# EAGLE design chicken_door_h_bridge_inv (EAGLE 5.11)
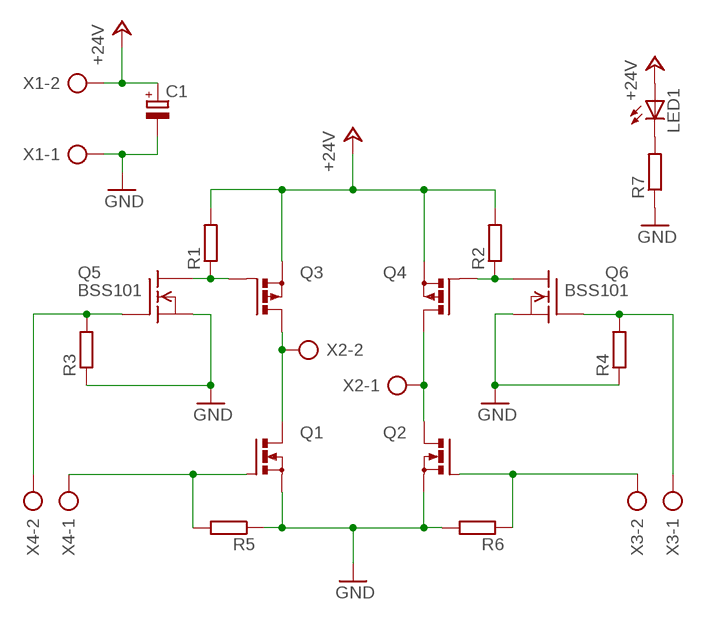
[diagram p0: schematic, sheet 1]

## Parts
C1  CPOL-EUE5-8.5  [E5-8,5]
LED1  LED3MM  [LED3MM]
Q1  PMOSFET_NTO220BV  [TO220BV]
Q2  PMOSFET_NTO220BV  [TO220BV]
Q3  PMOSFET_PTO220BV  [TO220BV]
Q4  PMOSFET_PTO220BV  [TO220BV]
Q5  BSS101  [TO92]
Q6  BSS101  [TO92]
R1  R-EU_0204/5  [0204/5]
R2  R-EU_0204/5  [0204/5]
R3  R-EU_0204/5  [0204/5]
R4  R-EU_0204/5  [0204/5]
R5  R-EU_0204/5  [0204/5]
R6  R-EU_0204/5  [0204/5]
R7  R-EU_0204/5  [0204/5]
X1  AK500/2  [AK500/2]
X2  AK500/2  [AK500/2]
X3  AK500/2  [AK500/2]
X4  AK500/2  [AK500/2]

## Nets
+24V: C1.+ LED1.A Q3.S Q4.S R1.2 R2.2 X1.2
GND: C1.- Q1.S Q2.S Q5.1(S) Q6.1(S) R3.1 R4.1 R5.1 R6.2 R7.1 X1.1
N$1: Q1.D Q3.D X2.2
N$2: Q2.D Q4.D X2.1
N$4: Q4.G Q6.3(D) R2.1
N$5: Q1.G R5.2 X4.1
N$6: Q2.G R6.1 X3.2
N$7: Q3.G Q5.3(D) R1.1
N$9: Q5.2(G) R3.2 X4.2
N$10: LED1.K(C) R7.2
N$11: Q6.2(G) R4.2 X3.1

## Library data of the parts
C1 = rcl:CPOL-EU: POLARIZED CAPACITOR, European symbol
LED1 = led:LED: LED OSRAM: - CHIPLED LG R971, LG N971, LY N971, LG Q971, LY Q971, LO R971, LY R971 LH N974, LH R974 LS Q976, LO Q976, LY Q976 LO Q996 - Hyper CHIPLED LW Q18S LB Q993, LB Q99A, LB R99A - SideLED LS A670, LO A670, LY A670, LG A670, LP A670 LB A673, LV A673, LT A673, LW A673 LH A674 LY A675 LS A676, LA A676, LO A676, LY A676, LW A676 LS A679, LY A679, LG A679 - Hyper Micro SIDELED® LS Y876, LA Y876, LO Y876, LY Y876 LT Y87S - SmartLED LW L88C, LW L88S LB L89C, LB L89S, LG L890 LS L89K, LO L89K, LY L89K LS L896, LA L896, LO L896, LY L896 - TOPLED LS T670, LO T670, LY T670, LG T670, LP T670 LSG T670, LSP T670, LSY T670, LOP T670, LYG T670 LG T671, LOG T671, LSG T671 LB T673, LV T673, LT T673, LW T673 LH T674 LS T676, LA T676, LO T676, LY T676, LB T676, LH T676, LSB T676, LW T676 LB T67C, LV T67C, LT T67C, LS T67K, LO T67K, LY T67K, LW E67C LS E67B, LA E67B, LO E67B, LY E67B, LB E67C, LV E67C, LT E67C LW T67C LS T679, LY T679, LG T679 LS T770, LO T770, LY T770, LG T770, LP T770 LB T773, LV T773, LT T773, LW T773 LH T774 LS E675, LA E675, LY E675, LS T675 LS T776, LA T776, LO T776, LY T776, LB T776 LHGB T686 LT T68C, LB T68C - Hyper Mini TOPLED® LB M676 - Mini TOPLED Santana® LG M470 LS M47K, LO M47K, LY M47K Source: http://www.osram.convergy.de LUXEON: - LUMILED® LXK2-PW12-R00, LXK2-PW12-S00, LXK2-PW14-U00, LXK2-PW14-V00 LXK2-PM12-R00, LXK2-PM12-S00, LXK2-PM14-U00 LXK2-PE12-Q00, LXK2-PE12-R00, LXK2-PE12-S00, LXK2-PE14-T00, LXK2-PE14-U00 LXK2-PB12-K00, LXK2-PB12-L00, LXK2-PB12-M00, LXK2-PB14-N00, LXK2-PB14-P00, LXK2-PB14-Q00 LXK2-PR12-L00, LXK2-PR12-M00, LXK2-PR14-Q00, LXK2-PR14-R00 LXK2-PD12-Q00, LXK2-PD12-R00, LXK2-PD12-S00 LXK2-PH12-R00, LXK2-PH12-S00 LXK2-PL12-P00, LXK2-PL12-Q00, LXK2-PL12-R00 Source: www.luxeon.com KINGBRIGHT: KA-3528ASYC Source: www.kingbright.com
Q1 Q2 = transistor-power:PMOSFET_N: Power MOSFET N-Channel
Q3 Q4 = transistor-power:PMOSFET_P: Power MOSFET P-Channel
Q5 Q6 = transistor-fet:BSS101: N-Channel Enhancement MOSFET 200V; 0,16A; 11Ohm
R1-R7 = resistor:R-EU_: RESISTOR, European symbol
X1-X4 = con-ptr500:AK500/2: CONNECTOR; OC_FARNELL: unknown; OC_NEWARK: unknown

## Board
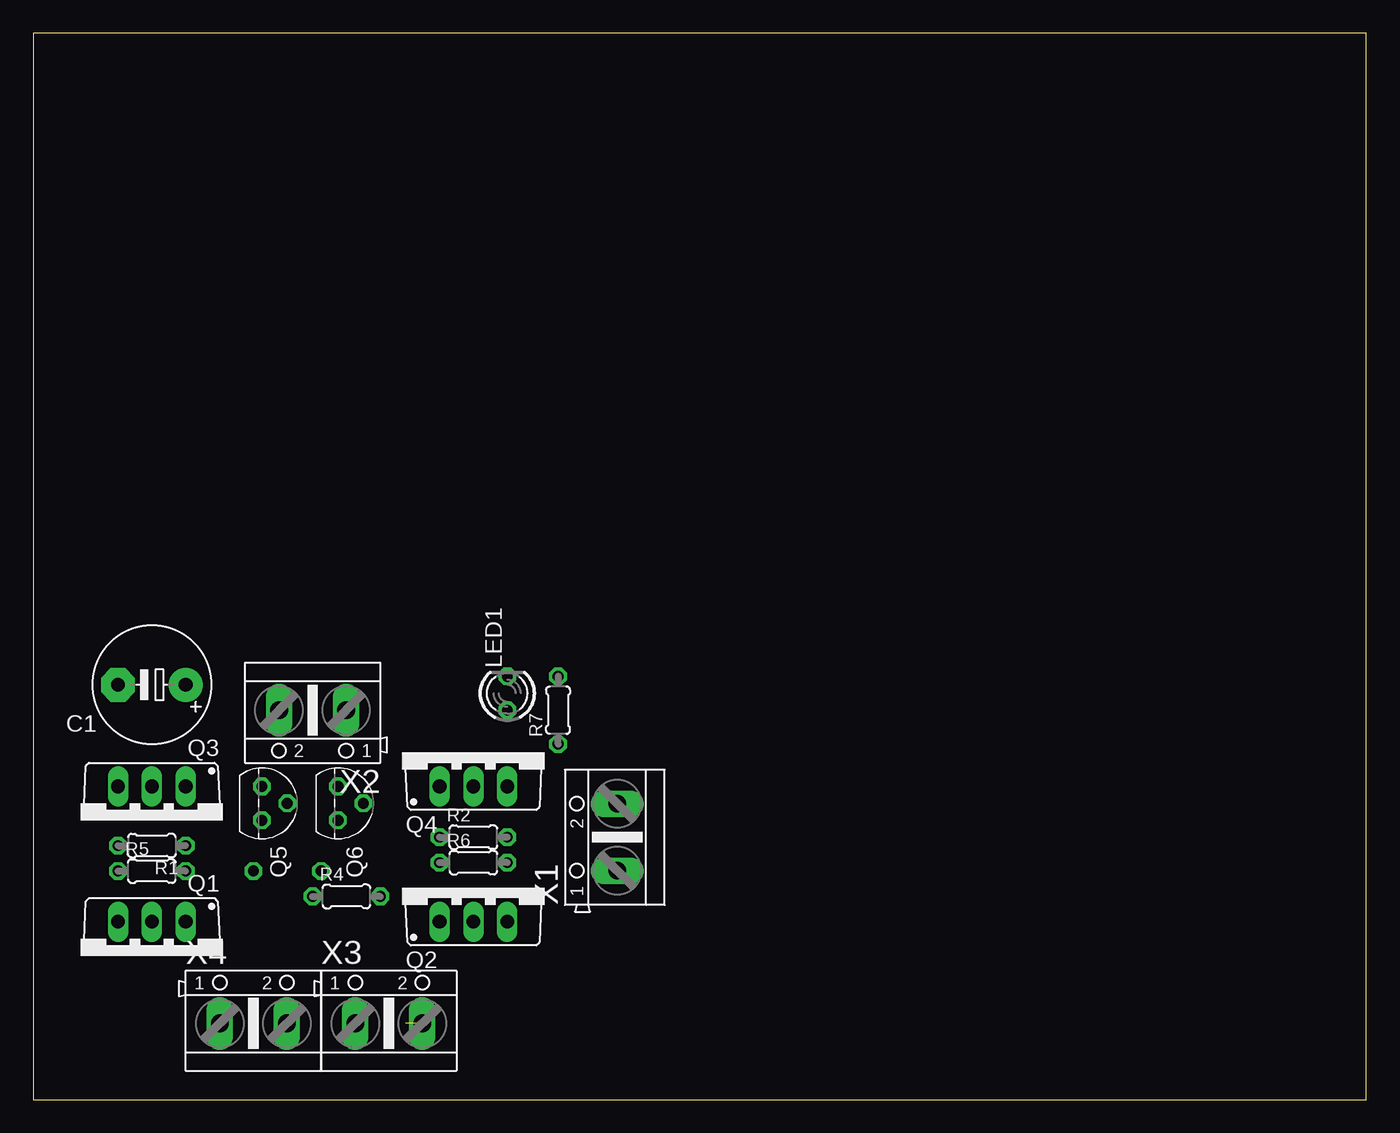
[diagram p1: board, top side]
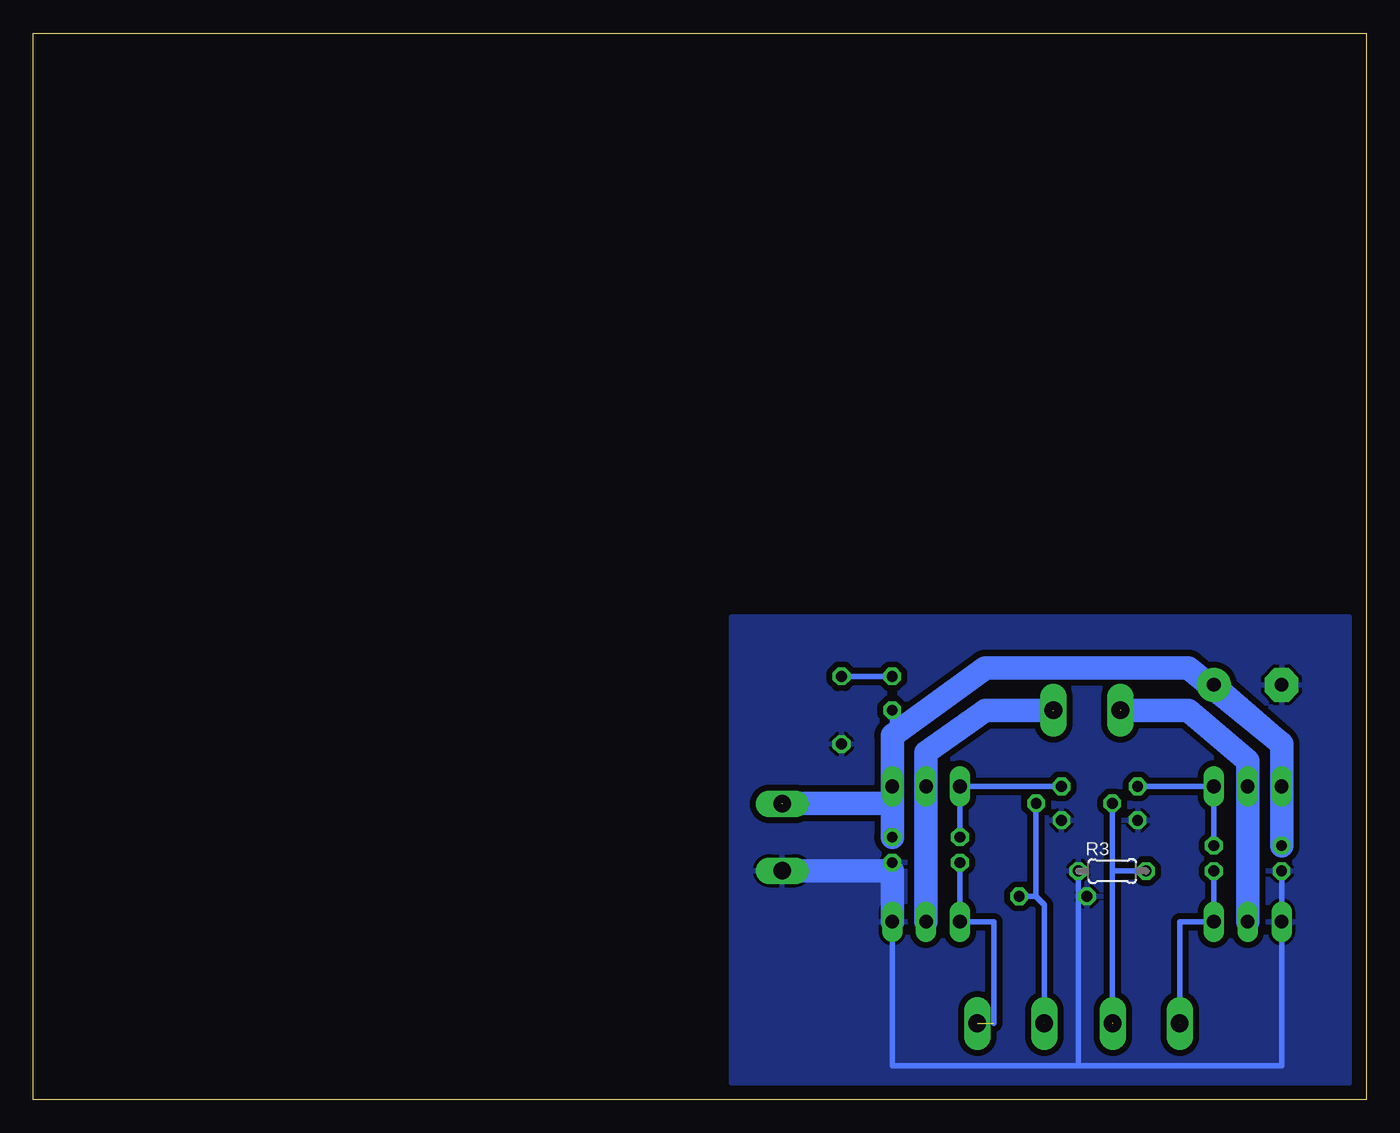
[diagram p2: board, bottom side, seen from below]

Size 100 x 80 mm. Coordinates in mm from the lower left corner, seen from the top.
Outline: 0,0 100,0 100,80 0,80 0,0
Copper layers (1*16): Top 0.035mm / dielectric 1.5mm / Bottom 0.035mm
Design rules "default *": minimum track width 10mil, minimum drill 24mil, track to track 18mil, track to pad 18mil, pad to pad 8mil, via to via 8mil, smd to smd 8mil, copper to edge 40mil, drill to drill 8mil, minimum pad ring 10mil, minimum via ring 8mil, stop-mask expansion 4mil, vias tented up to drill 0mil, thermal gap 10mil

### Footprints (pad centres in the part's own frame; a part is rotated, then mirrored left to right if it is on the bottom)
E5-8,5 = drill 1.016 pad 2.54 round: + -2.54,0 | drill 1.016 pad 2.54 octagon: - 2.54,0
LED3MM = drill 0.813 octagon: A -1.27,0; K 1.27,0
TO220BV = drill 1.016 long: D 0,-2.54; G -2.54,-2.54; S 2.54,-2.54
TO92 = drill 0.813 octagon: 1 1.27,0; 2 0,1.905; 3 -1.27,0
0204/5 = drill 0.813 octagon: 1 -2.54,0; 2 2.54,0
AK500/2 = drill 1.321 long: 1 -2.515,0; 2 2.515,0

### Placement (x,y rotation side)
C1  8.89,31.11 180 top
LED1  35.56,30.48 90 top
Q1  8.89,10.79 180 top
Q2  33.02,15.88 0 top
Q3  8.89,20.95 180 top
Q4  33.02,26.04 0 top
Q5  17.14,22.23 270 top
Q6  22.86,22.23 270 top
R1  8.89,19.05 180 top
R2  33.02,19.68 0 top
R3  19.05,17.14 0 bottom
R4  23.5,15.24 0 top
R5  8.89,17.14 0 top
R6  33.02,17.78 0 top
R7  39.37,29.21 90 top
X1  43.81,19.68 90 top
X2  20.95,29.21 180 top
X3  26.67,5.71 0 top
X4  16.51,5.71 0 top

### Tracks (layer width: path | path; a pad name or v marks a point on that pad's centre or on a via)
+24V  (1 unrouted)
  Bottom 0.406: 35.56,27.3 LED1.A
  Bottom 1.778: R1.2 Q3.S 6.35,26.67 | 6.35,26.67 13.34,32.38 28.57,32.38 35.56,27.3 Q4.S 35.56,22.23 | 35.56,22.23 R2.2 | 6.35,26.67 C1.+ | 35.56,22.23 43.81,22.23
GND
  Bottom 0.406: R5.1 Q1.S 6.35,2.54 21.59,2.54 | 21.59,2.54 35.56,2.54 Q2.S | 35.56,17.14 R6.2 | 21.59,2.54 R3.1
  Bottom 1.778: 43.81,17.14 35.56,17.14 Q2.S
  pour Bottom: 1.27,36.2 47.62,36.2 47.62,1.27 1.27,1.27
N$1  (1 unrouted)
  Bottom 1.778: Q1.D Q3.D 8.89,25.4 13.34,29.21 18.41,29.21
N$2  (1 unrouted)
  Bottom 1.778: Q2.D Q4.D 33.02,26.04 28.57,29.21 23.5,29.21
N$4
  Bottom 0.406: Q6.3 Q4.G R2.1
N$5  (1 unrouted)
  Bottom 0.406: R5.2 Q1.G 13.97,13.34 13.97,5.71
N$6  (1 unrouted)
  Bottom 0.406: R6.1 Q2.G 27.94,13.34 27.94,5.71
N$7
  Bottom 0.406: Q5.3 Q3.G R1.1
N$9  (1 unrouted)
  Bottom 0.406: 19.05,17.14 Q5.2 | 19.05,17.14 R3.2 | 19.05,5.71 19.05,17.14
N$10
  Bottom 0.406: LED1.K R7.2
N$11  (1 unrouted)
  Bottom 0.406: 24.77,15.24 Q6.2 | 24.13,5.71 24.13,14.61 24.77,15.24 | 24.77,15.24 R4.2